# Altium project RFload_2512.PrjPcb
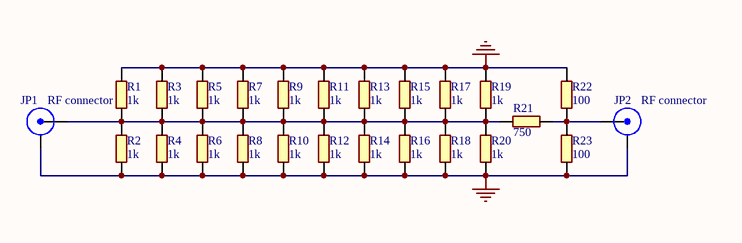
[diagram p0: RF_load_2512.SchDoc]
1 sheet, 25 parts. Net scope: global (net labels, ports and power ports of the same name join across sheets).
Board file: RF_load_2512.PcbDoc

## Sheet RF_load_2512.SchDoc
size 420 x 297 mm; SheetNumber: 1; SheetTotal: 1

### Parts
JP1  RF connector  [AMPHENOL_132357-11]
JP2  RF connector  [AMPHENOL_132357-11]
R1  1k  [R-2512_narrow]
R2  1k  [R-2512_narrow]
R3  1k  [R-2512_narrow]
R4  1k  [R-2512_narrow]
R5  1k  [R-2512_narrow]
R6  1k  [R-2512_narrow]
R7  1k  [R-2512_narrow]
R8  1k  [R-2512_narrow]
R9  1k  [R-2512_narrow]
R10  1k  [R-2512_narrow]
R11  1k  [R-2512_narrow]
R12  1k  [R-2512_narrow]
R13  1k  [R-2512_narrow]
R14  1k  [R-2512_narrow]
R15  1k  [R-2512_narrow]
R16  1k  [R-2512_narrow]
R17  1k  [R-2512_narrow]
R18  1k  [R-2512_narrow]
R19  1k  [R-2512_narrow]
R20  1k  [R-2512_narrow]
R21  750  [R-1206 _narrow]
R22  100  [R-1206 _narrow]
R23  100  [R-1206 _narrow]

### Nets
GND: JP1.2(Y) JP2.2(Y) R1.2 R2.1 R3.2 R4.1 R5.2 R6.1 R7.2 R8.1 R9.2 R10.1 R11.2 R12.1 R13.2 R14.1 R15.2 R16.1 R17.2 R18.1 R19.2 R20.1 R22.2 R23.1
NetJP1_1: JP1.1(X) R1.1 R2.2 R3.1 R4.2 R5.1 R6.2 R7.1 R8.2 R9.1 R10.2 R11.1 R12.2 R13.1 R14.2 R15.1 R16.2 R17.1 R18.2 R19.1 R20.2 R21.2
NetJP2_1: JP2.1(X) R21.1 R22.1 R23.2

### Notes on the sheet
- Перв. примен.
- Справ. №
- Подп. и дата
- Инв. № дубл.
- Взам. инв. №
- Изм.
- Лист
- № докум.
- Подп.
- Дата
- Лит.
- Масса
- Масштаб
- Т.контр.
- Пров.
- Разраб.
- Листов
- Инв. № подл.
- Н.контр.
- Утв.
- Копировал
- Формат А3

### Library data of the parts
JP1 JP2 = RF connector: Вид: Роз'єм; *: *
R1-R23 = RES: Точність/група: 5%; Вид: Резистор